# Altium schematic sheet advsensor.SchDoc
size A4
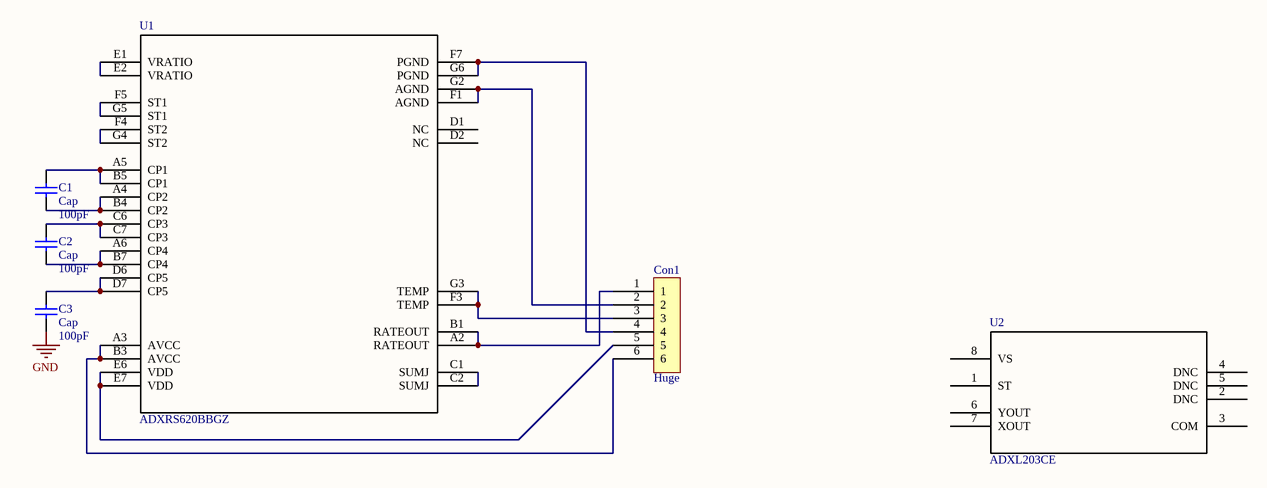
[diagram p0: advsensor.SchDoc]

## Parts
C1  Cap  value 100pF  [0805]
C2  Cap  value 100pF  [0805]
C3  Cap  value 100pF  [0805]
Con1  Huge  [HUGE2]
U1  ADXRS620BBGZ  [BG_32_3]
U2  ADXL203CE  [ADXL203]

## Nets
GND: C3.1
NetC1_1: C1.1 U1.A4(CP2) U1.B4(CP2)
NetC1_2: C1.2 U1.A5(CP1) U1.B5(CP1)
NetC2_1: C2.1 U1.A6(CP4) U1.B7(CP4)
NetC2_2: C2.2 U1.C6(CP3) U1.C7(CP3)
NetC3_2: C3.2 U1.D6(CP5) U1.D7(CP5)
NetCon1_1: Con1.1 U1.A2(RATEOUT) U1.B1(RATEOUT)
NetCon1_2: Con1.2 U1.F1(AGND) U1.G2(AGND)
NetCon1_3: Con1.3 U1.F3(TEMP) U1.G3(TEMP)
NetCon1_4: Con1.4 U1.F7(PGND) U1.G6(PGND)
NetCon1_5: Con1.5 U1.E6(VDD) U1.E7(VDD)
NetCon1_6: Con1.6 U1.A3(AVCC) U1.B3(AVCC)
NetU1_C1: U1.C1(SUMJ) U1.C2(SUMJ)
NetU1_E1: U1.E1(VRATIO) U1.E2(VRATIO)
NetU1_F4: U1.F4(ST2) U1.G4(ST2)
NetU1_F5: U1.F5(ST1) U1.G5(ST1)

Not connected (* = marked no-connect by the designer): U1 D1(NC) D2(NC); U2 1(ST) 2(DNC) 3(COM) 4(DNC) 5(DNC) 6(YOUT) 7(XOUT) 8(VS)

## Library data of the parts
C1-C3 = Cap: Capacitor; Published: 8-Jun-2000; LatestRevisionDate: 17-Jul-2002; LatestRevisionNote: Re-released for DXP Platform.; PackageReference: RAD-0.3; Publisher: Altium Limited; PackageDescription: Radial Cap, Thru-Hole; 2 Leads; 0.3 in Pin Spacing
U1 = ADXRS620BBGZ: Imported; Manufacturer_Part_Number: ADXRS613BBGZ; Vendor: Vendor; RefDes: RefDes; Type: DEV; Value: Value
U2 = ADXL203CE: Imported; RefDes: RefDes; Type: DEV; Value: Value